# EAGLE design LB_BIT_w8-latch_v03(1_1) (EAGLE 6.6.0)
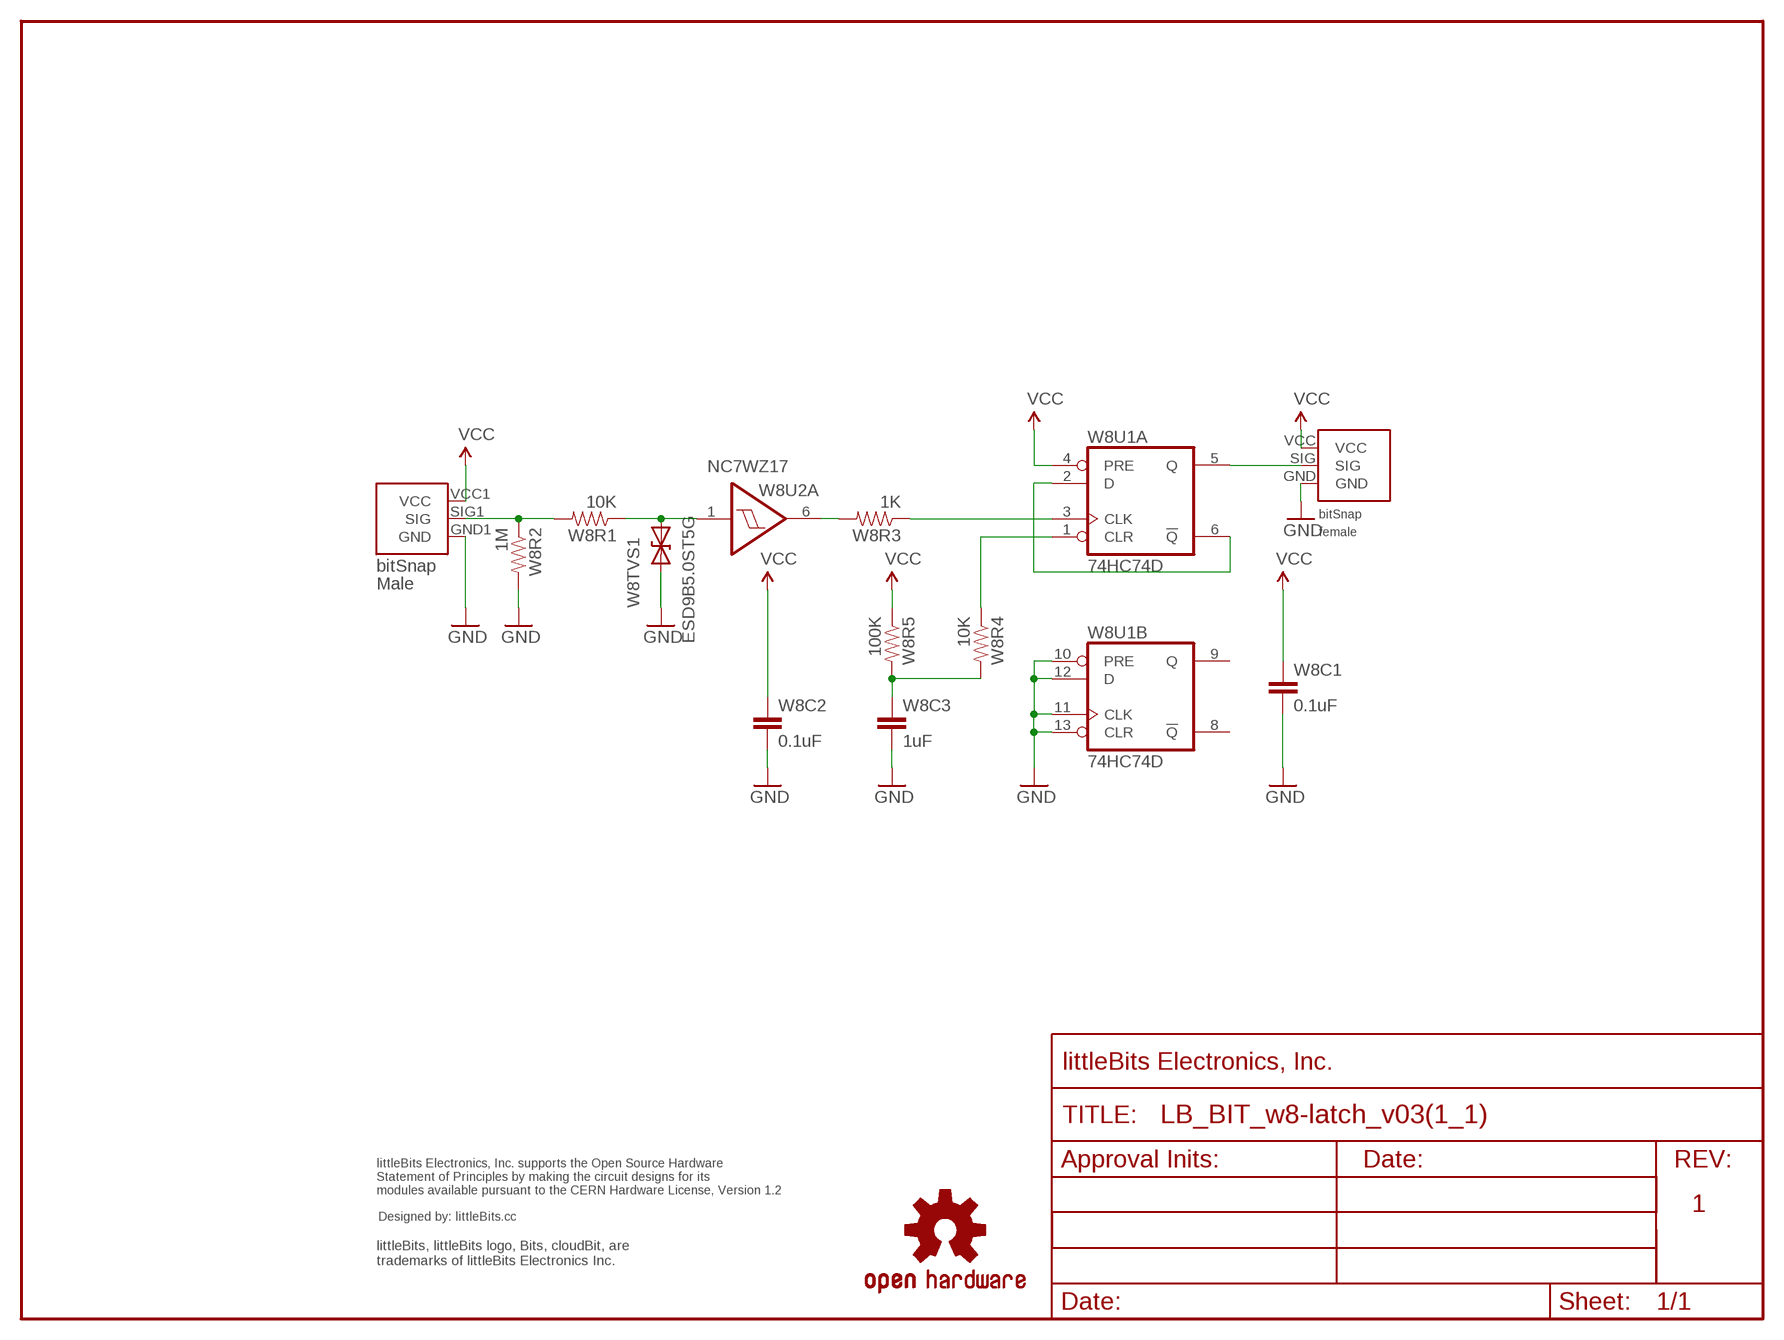
[diagram p0: schematic, sheet 1]

## Parts
U$1  OSHW-LOGOL  [OSHW-LOGO-L]
U$2  OSHWCREDIT  [OSHWCREDIT]
U$12  FRAME-LETTER-OHWOHW  [FABDWG01-OHW]
W8BSF1  BITSNAP_V03_FEMALE  [BITSNAP_V03_FEMALE]
W8BSM1  BITSNAP_V03_MALE  [BITSNAP_V03_MALE]
W8C1  0.1uF  CAP0603-CAP  [0603-CAP]
W8C2  0.1uF  CAP0603-CAP  [0603-CAP]
W8C3  1uF  CAP0603-CAP  [0603-CAP]
W8R1  10K  RESISTOR0603-RES  [0603-RES]
W8R2  1M  RESISTOR0603-RES  [0603-RES]
W8R3  1K  RESISTOR0603-RES  [0603-RES]
W8R4  10K  RESISTOR0603-RES  [0603-RES]
W8R5  100K  RESISTOR0603-RES  [0603-RES]
W8TVS1  ESD9B5.0ST5G  DIODE-TVSSOD-923  [SOD-923]
W8U1  74HC74D  [SO14]
W8U2  SCHMITT_TRIGGER_NON_INVERTINGNC7WZ17  [SC70-6]

## Nets
D1: W8U1.2(A:D) W8U1.6(A:!Q)
GND: W8BSF1.GND W8BSM1.GND1(GND) W8C1.2 W8C2.2 W8C3.2 W8R2.2 W8TVS1.1(A) W8U1.10(B:PRE) W8U1.11(B:CLK) W8U1.12(B:D) W8U1.13(B:CLR)
N$1: W8R3.2 W8U2.6(A:O)
N$2: W8BSM1.SIG1(SIG) W8R1.2 W8R2.1
N$3: W8R1.1 W8TVS1.2(C) W8U2.1(A:I)
N$4: W8BSF1.SIG W8U1.5(A:Q)
N$5: W8R4.1 W8U1.1(A:CLR)
N$6: W8C3.1 W8R4.2 W8R5.2
N$8: W8R3.1 W8U1.3(A:CLK)
VCC: W8BSF1.VCC W8BSM1.VCC1(VCC) W8C1.1 W8C2.1 W8R5.1 W8U1.4(A:PRE)
Unconnected: W8U1.8(B:!Q) W8U1.9(B:Q) W8U2.3(B:I) W8U2.4(B:O)

## Notes on the sheet
- NC7WZ17
- 1

## Power pins joined to a net without a drawn wire
GND: W8U1.7(P:GND) W8U2.2(PWR:GND)
VCC: W8U1.14(P:VCC) W8U2.5(PWR:VCC)

## Library data of the parts
U$1 = LITTLEBITS:OSHW-LOGO: Open Source Hardware Logo This logo indicates the piece of hardware it is found on incorporates a OSHW license and/or adheres to the definition of open source hardware found here: http://freedomdefined.org/OSHW
U$2 = LITTLEBITS:OSHWCREDIT
U$12 = LITTLEBITS:FRAME-LETTER-OHW
W8BSF1 = bitSnap:BITSNAP_V03_FEMALE
W8BSM1 = bitSnap:BITSNAP_V03_MALE
W8C1-W8C3 = SparkFun:CAP: Capacitor Standard 0603 ceramic capacitor, and 0.1" leaded capacitor.
W8R1-W8R5 = SparkFun:RESISTOR: Resistor Basic schematic elements and footprints for 0603, 1206, and PTH 1/10th watt (small) resistors.
W8TVS1 = LITTLEBITS:DIODE-TVS: Bidirectional Transient Voltage Suppression Diode: Device conducts in avalanche mode after reaching a part dependent voltage threshold. Used for limiting voltage spikes on ESD sensitive inputs and outputs.; IEC_ESD_PROT0: +/-18kV; LB_PN: ?; MPN: ESD9B5.0ST5G; V_CLAMP: ?; V_OPERATION: 5V
W8U1 = 74xx-eu:74*74: Dual D type positive edge triggered FLIP FLOP, preset and clear
W8U2 = LITTLEBITS:SCHMITT_TRIGGER_NON_INVERTING

## Board
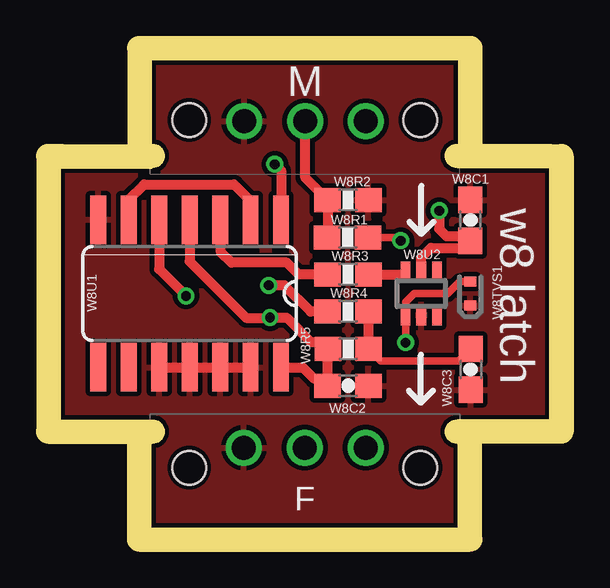
[diagram p1: board, top side]
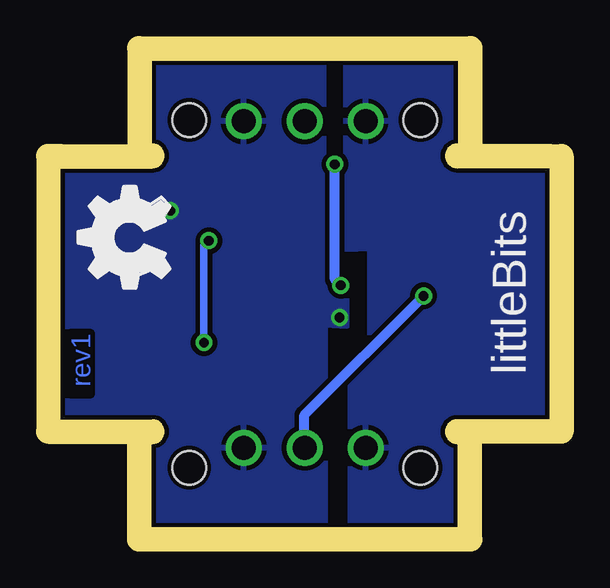
[diagram p2: board, bottom side, seen from below]

Size 20.4 x 19.5 mm. Coordinates in mm from the lower left corner, seen from the top.
Outline: 0,15 0,4.5
Outline: 20.4,4.5 20.4,15
Copper layers (1*16): Top 0.035mm / dielectric 1.5mm / Bottom 0.035mm
Design rules "littleBitsDRC": minimum track width 0.2mm, minimum drill 0.4mm, track to track 0.2mm, track to pad 0.2mm, pad to pad 0.2mm, via to via 0.2mm, smd to smd 0mil, copper to edge 0.2mm, drill to drill 0.2mm, minimum pad ring 0.2mm, minimum via ring 0.15mm, stop-mask expansion 0.1mm, vias tented up to drill 0mil, thermal gap 0.2mm
Milling: 6 lines

### Footprints (pad centres in the part's own frame; a part is rotated, then mirrored left to right if it is on the bottom)
BITSNAP_V03_FEMALE = drill 1: GND 3.91,3.33; SIG 6.45,3.33; VCC 8.99,3.33 | hole 1.4: 1.63,2.5; 11.27,2.5
BITSNAP_V03_MALE = drill 1: GND1 8.98,2.56; SIG1 6.44,2.56; VCC1 3.9,2.56 | hole 1.4: 11.27,2.5; 1.63,2.5
0603-CAP = smd 1.1 x 1: 1 -0.85,0; 2 0.85,0
0603-RES = smd 1.1 x 1: 1 -0.85,0; 2 0.85,0
SOD-923 = smd 0.4 x 0.5: 1 -0.5,0; 2 0.5,0
SO14 = smd 0.66 x 2.032: 1 -3.81,-3.073; 2 -2.54,-3.073; 3 -1.27,-3.073; 4 0,-3.073; 5 1.27,-3.073; 6 2.54,-3.073; 7 3.81,-3.073; 8 3.81,3.073; 9 2.54,3.073; 10 1.27,3.073; 11 0,3.073; 12 -1.27,3.073; 13 -2.54,3.073; 14 -3.81,3.073
SC70-6 = smd 0.4 x 0.85: 1 -0.65,-0.9; 2 0,-0.9; 3 0.65,-0.9; 4 0.65,0.9; 5 0,0.9; 6 -0.65,0.9

### Placement (x,y rotation side)
U$1  -24.65,-71.1 0 top  (outside the outline)
U$2  -91.7,-62.6 0 top  (outside the outline)
U$10  [OSHW_FILLX150_NOTEXT]  15.82,9.15 0 top
U$12  0,0 0 top
W8BSF1  3.75,0 0 top
W8BSM1  16.65,19.5 180 top
W8C1  17.1,12.81 90 top
W8C2  12,5.91 0 top
W8C3  17.11,6.6 270 top
W8R1  11.98,12.1 180 top
W8R2  12,13.66 0 top
W8R3  12,10.56 0 top
W8R4  12,9.01 0 top
W8R5  12.01,7.45 0 top
W8TVS1  17.1,9.76 90 top
W8U1  5.4,9.76 180 top
W8U2  15.05,9.76 0 top

### Tracks (layer width: path | path; a pad name or v marks a point on that pad's centre or on a via)
D1
  Top 0.406: W8U1.6 2.86,13.67 3.5,14.31 7.25,14.31 7.95,13.61 7.95,12.84 W8U1.2
GND
  Top 0.406: W8U1.10 W8U1.11 W8U1.12 W8U1.13
  pour Bottom: 0.15,19.35 8.5,19.3 8.5,11.61 7.5,11.66 7.5,7.51 8.3,7.51 8.3,0.15 0.15,0.15
  pour Top: 0.15,19.4 20.25,19.4 20.25,0.1 0.15,0.15
N$1
  Top 0.406: W8R3.2 14.3,10.56 W8U2.6
N$2
  Top 0.406: W8R1.2 11.15,12.12 W8R2.1 10.22,14.59 W8BSM1.SIG1
N$3  (via drill 0.41)
  Top 0.305: W8TVS1.2 16.65,10.26 16.15,9.76 14.75,9.76 14.4,9.41 W8U2.1 v14.4,7.71 | W8R1.1 14.06,12.1 v14.2,11.96
  Bottom 0.305: v14.2,11.96 14.4,11.76 v14.4,7.71
N$4  (via drill 0.41)
  Top 0.406: W8U1.5 4.13,10.78 v5.25,9.66
  Bottom 0.406: W8BSF1.SIG 10.22,4.69 v5.25,9.66
N$5  (via drill 0.41)
  Top 0.406: W8R4.1 10.44,9.01 9.35,10.1 v8.7,10.1 | v8.95,15.15 9.21,14.89 W8U1.1
  Bottom 0.406: v8.7,10.1 8.95,10.35 v8.95,15.15
N$6
  Top 0.305: W8R5.2 13.36,6.95 16.61,6.95 W8C3.1
  Top 0.406: W8R4.2 W8R5.2
N$8
  Top 0.406: W8R3.1 9.94,10.56 9.45,11.05 7.15,11.05 6.7,11.5 6.7,12.8 W8U1.3
VCC  (via drill 0.41)
  Top 0.406: W8U2.5 15.05,11.26 15.45,11.66 16.8,11.66 W8C1.1 | W8C1.1 16.89,11.96 | v15.8,13.21 15.8,12.45 16.1,12.15 16.91,12.15 W8C1.1 | W8U1.14 10.11,6.69 10.6,6.2 10.86,6.2 W8C2.1 W8R5.1 10.86,7.75 10.45,7.75 9.44,8.76 v8.75,8.76 v8.74,8.75 7.75,8.75 5.4,11.1 W8U1.4
  pour Bottom: 9.4,19.41 20.25,19.36 20.25,0.11 9.35,0.21 9.35,8.46 8.45,8.41 8.45,10.61 9.4,10.61

### Text on the board
Bottom: rev1
tPlace: w8 latch
bPlace: littleBits
dxf: 1 | Bistable Flip-Flop Bit